# EAGLE design SwitchPi-v0.2 (EAGLE 6.4)
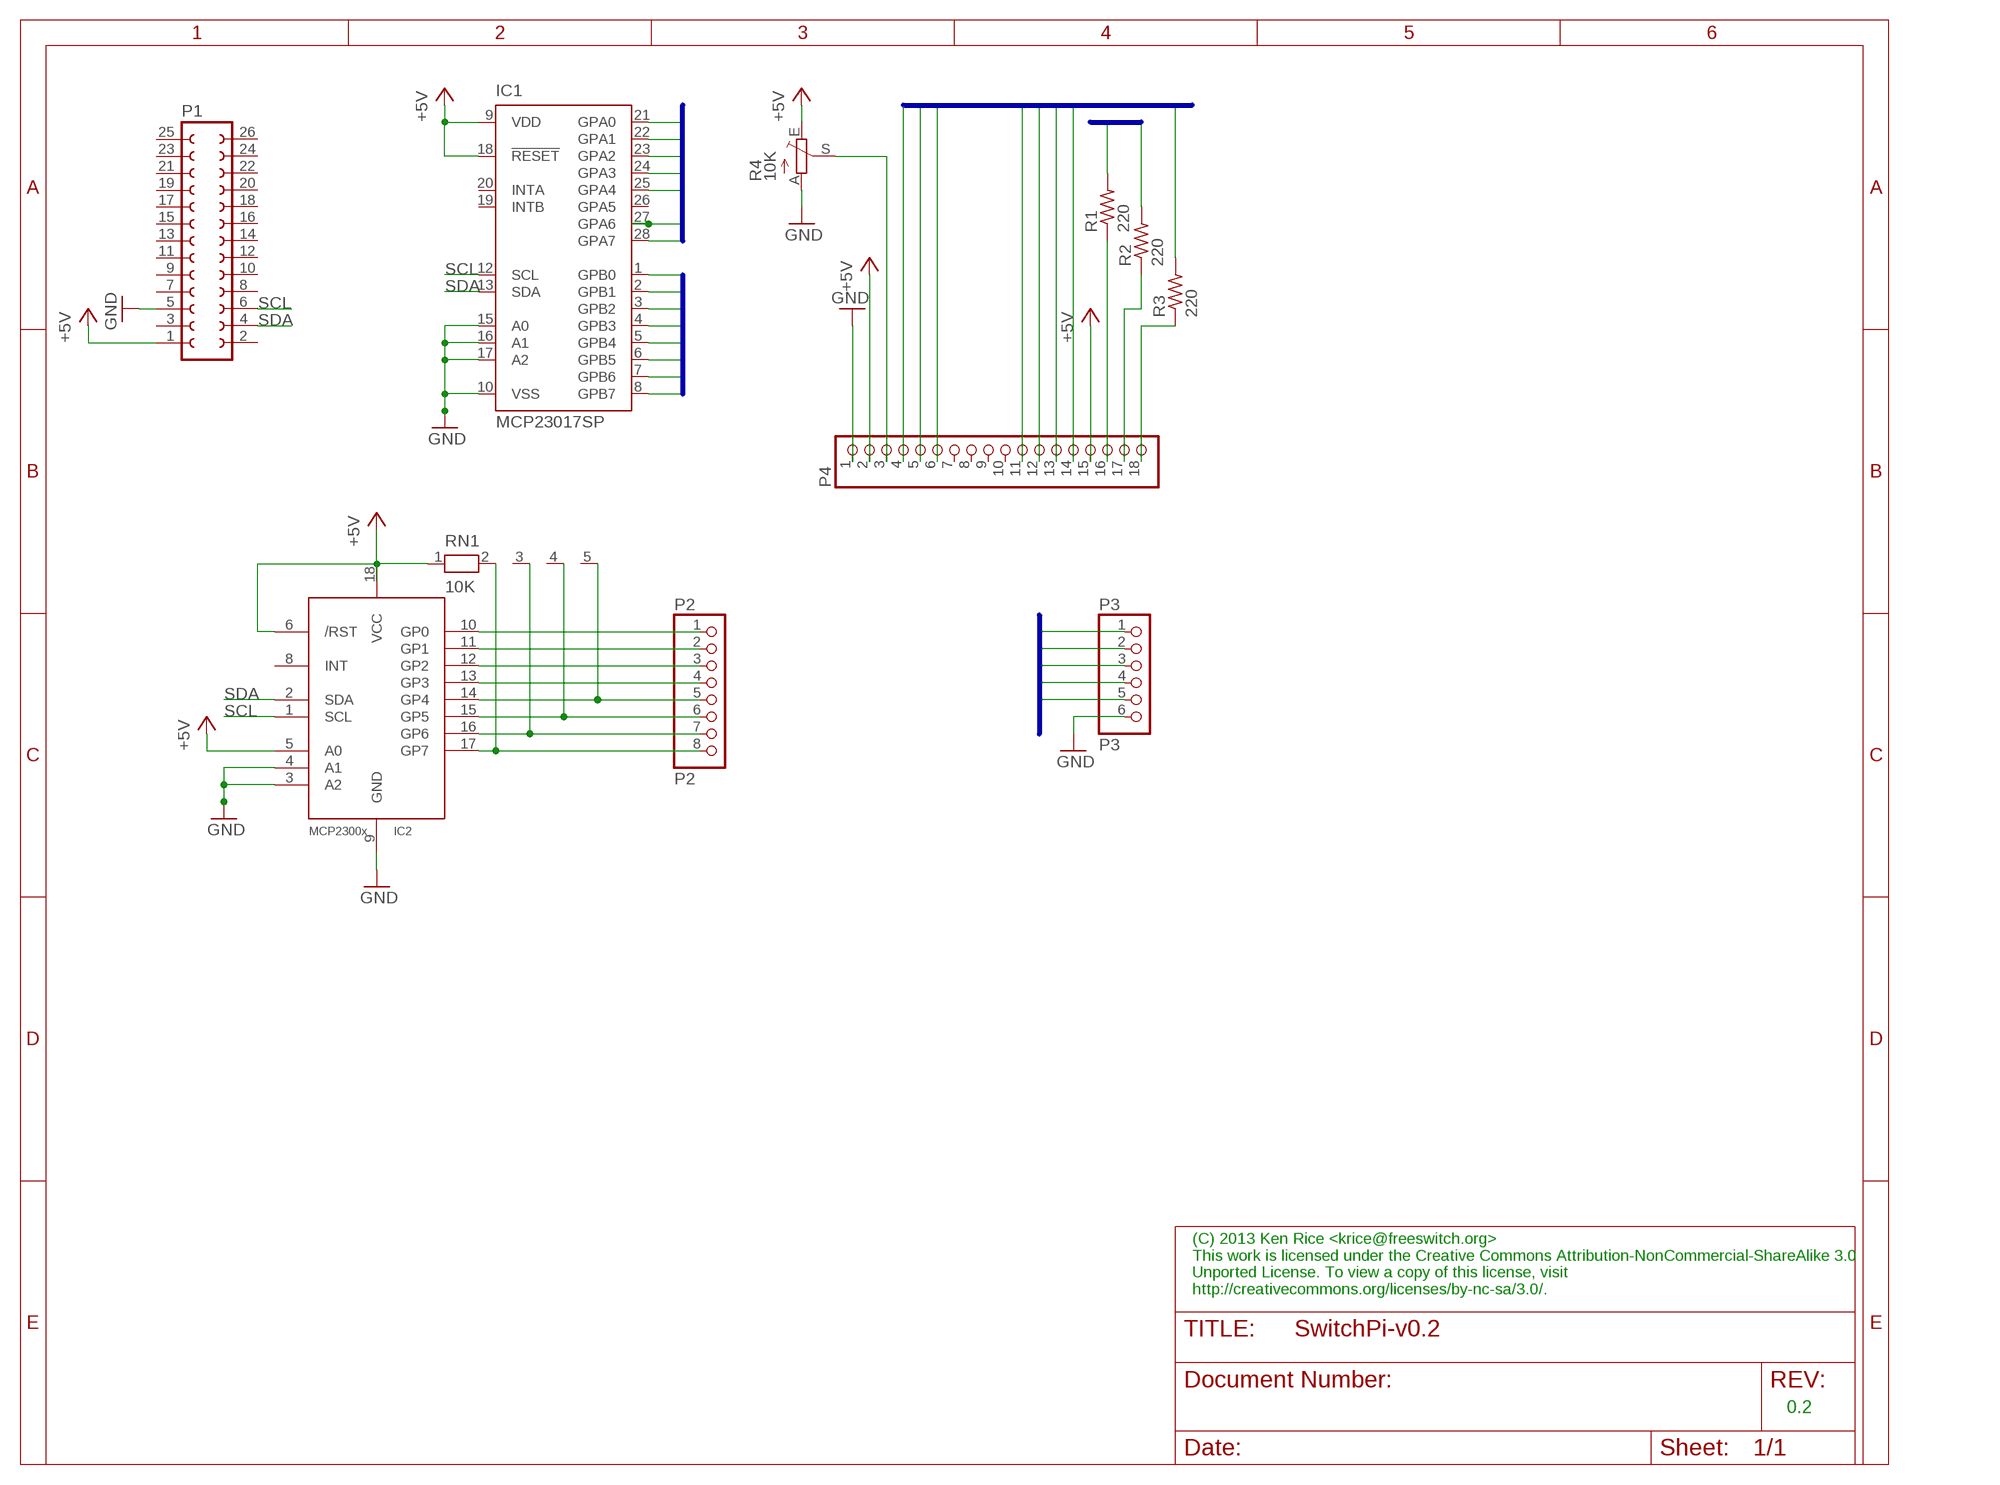
[diagram p0: schematic, sheet 1]

## Parts
IC1  MCP23017SP  [DIL28-3]
IC2  MCP2300X/P  [DIL18]
P1  FE13-2  [FE13-2]
P2  P2  PINHD-1X8BIG  [1X08-BIG]
P3  P3  PINHD-1X6  [1X06]
P4  PINHD-1X18-BIG  [1X18-BIG]
R1  220  R-US_0207/10  [0207/10]
R2  220  R-US_0207/10  [0207/10]
R3  220  R-US_0207/10  [0207/10]
R4  10K  TRIM_EU-CA6V  [CA6V]
RN1  10K  RN04  [RN-5]

## Nets
+5V: IC1.9(VDD) IC1.18(!RESET) IC2.5(A0) IC2.6(/RST) IC2.18(VCC) P1.1 P4.2 P4.15 R4.E RN1.1
GND: IC1.10(VSS) IC1.15(A0) IC1.16(A1) IC1.17(A2) IC2.3(A2) IC2.4(A1) IC2.9(GND) P1.5 P3.6 P4.1 R4.A
GPA0: IC1.21(GPA0) P3.1
GPA1: IC1.22(GPA1) P3.2
GPA2: IC1.23(GPA2) P3.3
GPA3: IC1.24(GPA3) P3.4
GPA4: IC1.25(GPA4) P3.5
GPA6: IC1.27(GPA6) R1.2
GPA7: IC1.28(GPA7) R2.2
GPB0: IC1.1(GPB0) R3.2
GPB1: IC1.2(GPB1) P4.14
GPB2: IC1.3(GPB2) P4.13
GPB3: IC1.4(GPB3) P4.12
GPB4: IC1.5(GPB4) P4.11
GPB5: IC1.6(GPB5) P4.6
GPB6: IC1.7(GPB6) P4.5
GPB7: IC1.8(GPB7) P4.4
N$1: IC2.10(GP0) P2.1
N$2: IC2.11(GP1) P2.2
N$3: P4.3 R4.S
N$4: IC2.12(GP2) P2.3
N$5: P4.16 R1.1
N$6: IC2.13(GP3) P2.4
N$7: IC2.14(GP4) P2.5 RN1.5
N$8: IC2.15(GP5) P2.6 RN1.4
N$9: IC2.16(GP6) P2.7 RN1.3
N$10: IC2.17(GP7) P2.8 RN1.2
N$13: P4.17 R2.1
N$14: P4.18 R3.1
SCL: IC1.12(SCL) IC2.1(SCL) P1.6
SDA: IC1.13(SDA) IC2.2(SDA) P1.4
Unconnected: IC1.19(INTB) IC1.20(INTA) IC1.26(GPA5) IC2.8(INT) P1.2 P1.3 P1.7 P1.8 P1.9 P1.10 P1.11 P1.12 P1.13 P1.14 P1.15 P1.16 P1.17 P1.18 P1.19 P1.20 P1.21 P1.22 P1.23 P1.24 P1.25 P1.26 P4.7 P4.8 P4.9 P4.10

## Buses
GPA[0..7]
GPB[0..7]

## Notes on the sheet
- (C) 2013 Ken Rice <krice@freeswitch.org>
  This work is licensed under the Creative Commons Attribution-NonCommercial-ShareAlike 3.0 
  Unported License. To view a copy of this license, visit
  http://creativecommons.org/licenses/by-nc-sa/3.0/.
- 0.2

## Library data of the parts
IC1 = microchip:MCP23017: http://ww1.microchip.com/downloads/en/DeviceDoc/21952a.pdf Source: http://ww1.microchip.com/downloads/en/DeviceDoc/21952a.pdf; MF: MICROCHIP; MPN: MCP23017-E/SP; OC_FARNELL: 1332088; OC_NEWARK: 31K2959
IC2 = adafruit:MCP2300X: MCP23008 Inexpensive i2c i/o expander - 8 general purpose i/o pins with optional pullups
P1 = con-lsta:FE13-2: FEMALE HEADER; OC_FARNELL: unknown; OC_NEWARK: unknown
P2 = adafruit:PINHD-1X8: PIN HEADER
P3 = adafruit:PINHD-1X6: PIN HEADER
P4 = adafruit:PINHD-1X18: PIN HEADER
R1-R3 = resistor:R-US_: RESISTOR, American symbol
R4 = pot:TRIM_EU-: POTENTIOMETER
RN1 = resistor-net:RN04: RESISTOR NETWORK; OC_FARNELL: unknown; OC_NEWARK: unknown

## Board
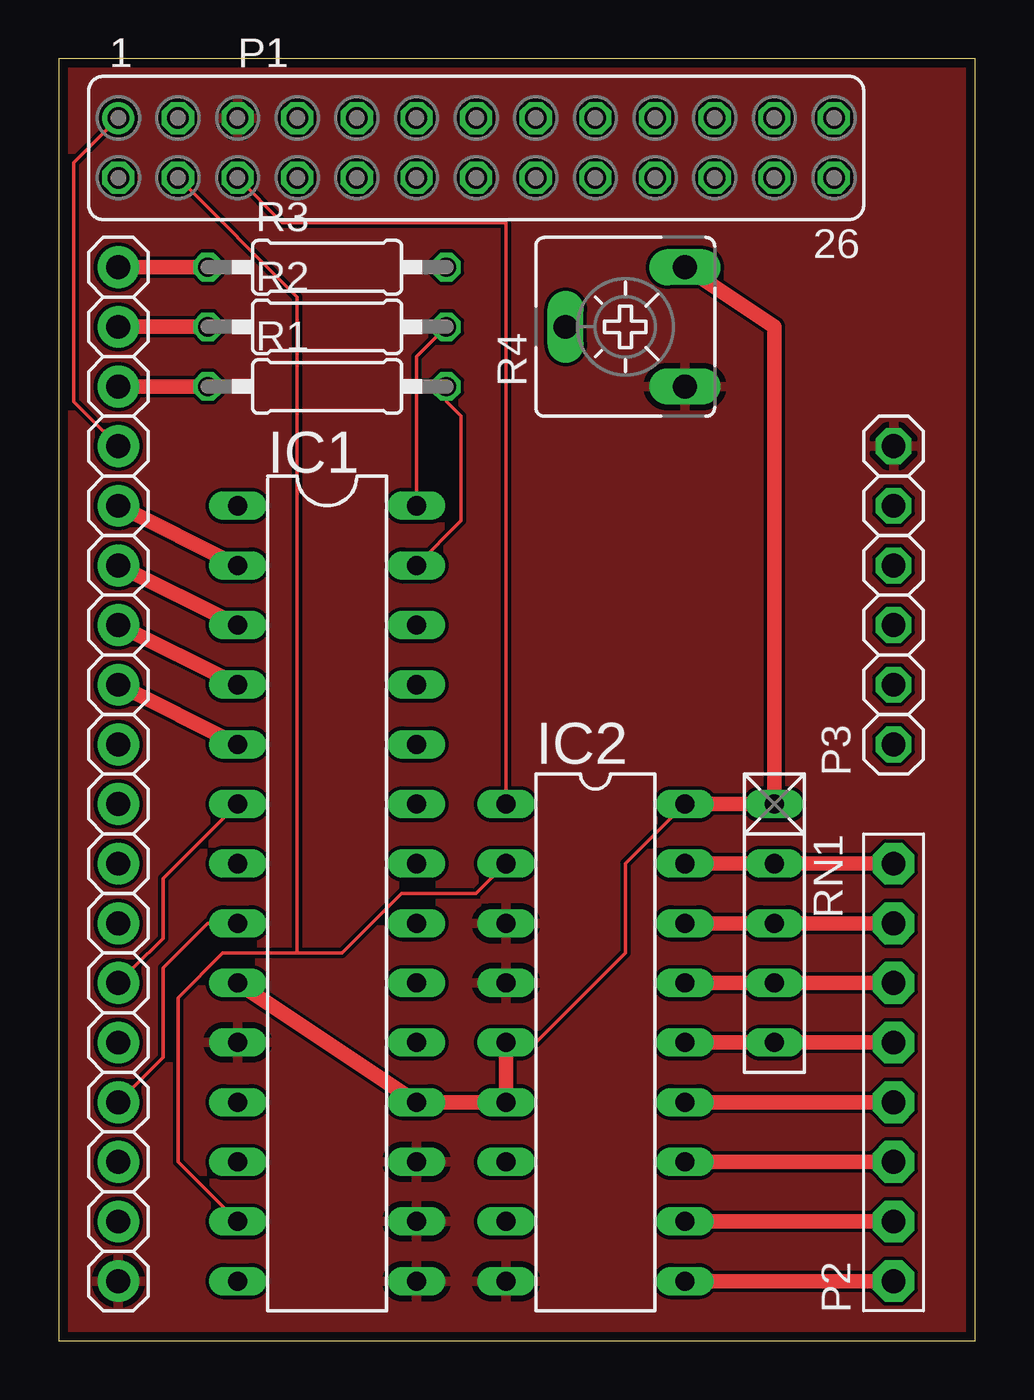
[diagram p1: board, top side]
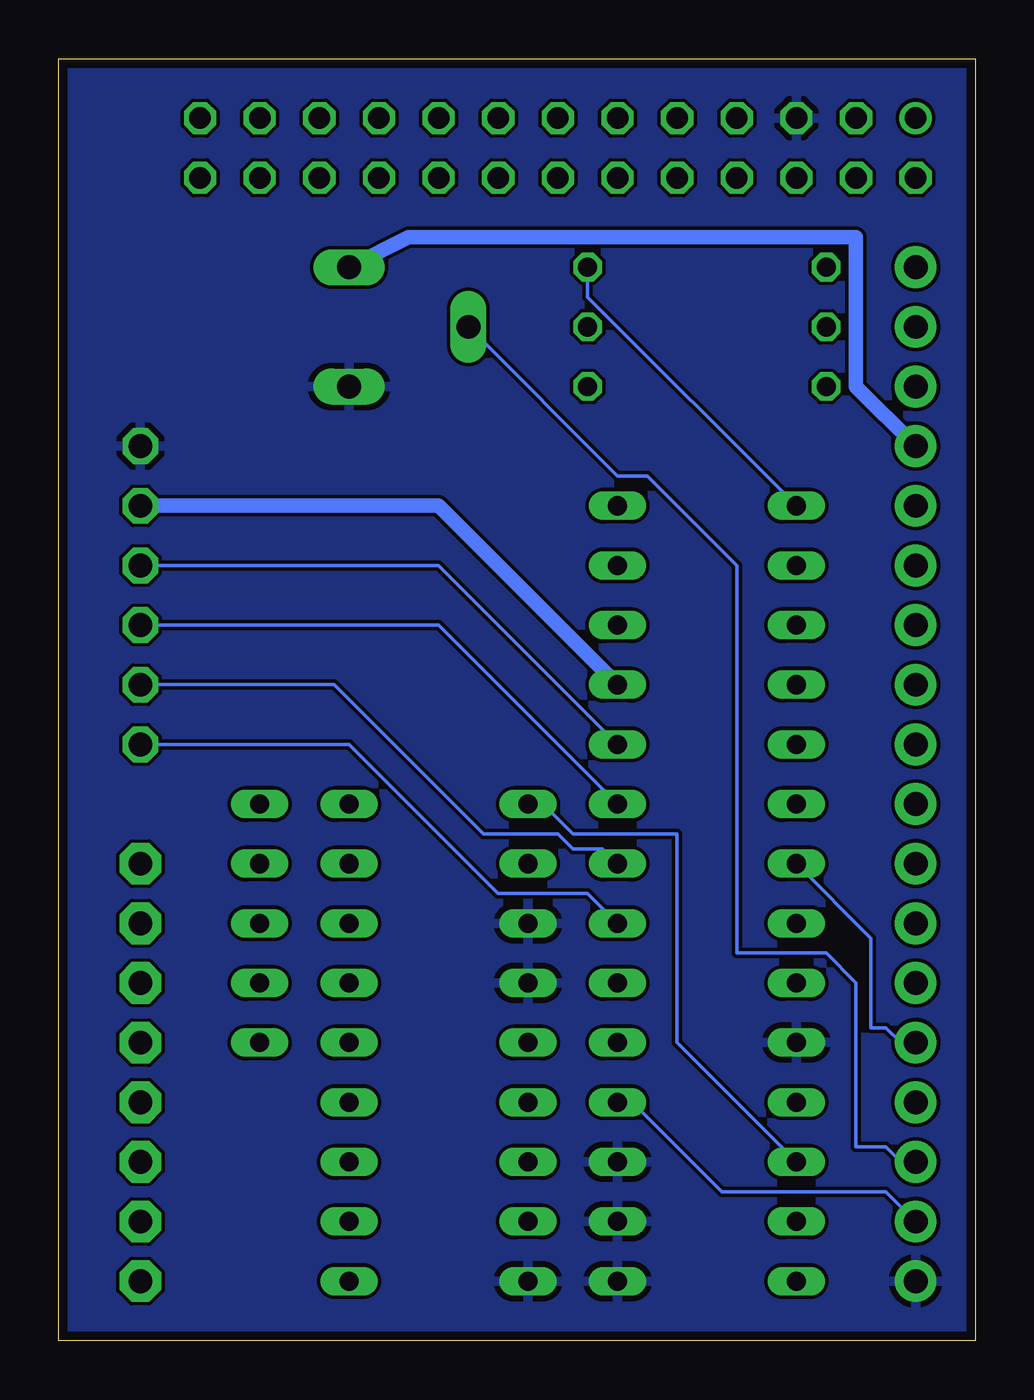
[diagram p2: board, bottom side, seen from below]

Size 39.04 x 54.6 mm. Coordinates in mm from the lower left corner, seen from the top.
Outline: 0,0 39.04,0 39.04,54.6 0,54.6 0,0
Copper layers (1*16): Top 0.0356mm / dielectric 1.5011mm / Bottom 0.0356mm
Design rules "LaenPCBOrder": minimum track width 6mil, minimum drill 13mil, track to track 6mil, track to pad 6mil, pad to pad 6mil, via to via 6mil, smd to smd 6mil, copper to edge 15mil, drill to drill 6mil, minimum pad ring 7mil, minimum via ring 7mil, stop-mask expansion 4mil, vias tented up to drill 0mil, thermal gap 10mil

### Footprints (pad centres in the part's own frame; a part is rotated, then mirrored left to right if it is on the bottom)
DIL28-3 = drill 0.813 long: 1 -16.51,-3.81; 2 -13.97,-3.81; 3 -11.43,-3.81; 4 -8.89,-3.81; 5 -6.35,-3.81; 6 -3.81,-3.81; 7 -1.27,-3.81; 8 1.27,-3.81; 9 3.81,-3.81; 10 6.35,-3.81; 11 8.89,-3.81; 12 11.43,-3.81; 13 13.97,-3.81; 14 16.51,-3.81; 15 16.51,3.81; 16 13.97,3.81; 17 11.43,3.81; 18 8.89,3.81; 19 6.35,3.81; 20 3.81,3.81; 21 1.27,3.81; 22 -1.27,3.81; 23 -3.81,3.81; 24 -6.35,3.81; 25 -8.89,3.81; 26 -11.43,3.81; 27 -13.97,3.81; 28 -16.51,3.81
DIL18 = drill 0.813 long: 1 -10.16,-3.81; 2 -7.62,-3.81; 3 -5.08,-3.81; 4 -2.54,-3.81; 5 0,-3.81; 6 2.54,-3.81; 7 5.08,-3.81; 8 7.62,-3.81; 9 10.16,-3.81; 10 10.16,3.81; 11 7.62,3.81; 12 5.08,3.81; 13 2.54,3.81; 14 0,3.81; 15 -2.54,3.81; 16 -5.08,3.81; 17 -7.62,3.81; 18 -10.16,3.81
FE13-2 = drill 0.914: 1 -15.24,1.27 | drill 0.914 octagon: 2 -15.24,-1.27; 3 -12.7,1.27; 4 -12.7,-1.27; 5 -10.16,1.27; 6 -10.16,-1.27; 7 -7.62,1.27; 8 -7.62,-1.27; 9 -5.08,1.27; 10 -5.08,-1.27; 11 -2.54,1.27; 12 -2.54,-1.27; 13 0,1.27; 14 0,-1.27; 15 2.54,1.27; 16 2.54,-1.27; 17 5.08,1.27; 18 5.08,-1.27; 19 7.62,1.27; 20 7.62,-1.27; 21 10.16,1.27; 22 10.16,-1.27; 23 12.7,1.27; 24 12.7,-1.27; 25 15.24,1.27; 26 15.24,-1.27
1X08-BIG = drill 1.016 pad 1.778 octagon: 1 -8.89,0; 2 -6.35,0; 3 -3.81,0; 4 -1.27,0; 5 1.27,0; 6 3.81,0; 7 6.35,0; 8 8.89,0
1X06 = drill 1.016 octagon: 1 -6.35,0; 2 -3.81,0; 3 -1.27,0; 4 1.27,0; 5 3.81,0; 6 6.35,0
1X18-BIG = drill 1.016 pad 1.778: 1 -21.59,0; 2 -19.05,0; 3 -16.51,0; 4 -13.97,0; 5 -11.43,0; 6 -8.89,0; 7 -6.35,0; 8 -3.81,0; 9 -1.27,0; 10 1.27,0; 11 3.81,0; 12 6.35,0; 13 8.89,0; 14 11.43,0; 15 13.97,0; 16 16.51,0; 17 19.05,0; 18 21.59,0
0207/10 = drill 0.813 octagon: 1 -5.08,0; 2 5.08,0
CA6V = drill 1.016 long: A -2.54,-2.54; E 2.54,-2.54; S 0,2.54
RN-5 = drill 0.813 long: 1 -5.08,0; 2 -2.54,0; 3 0,0; 4 2.54,0; 5 5.08,0

### Placement (x,y rotation side)
IC1  11.43,19.05 270 top
IC2  22.86,12.7 270 top
P1  17.78,50.8 0 top
P2  35.56,11.43 90 top
P3  35.56,31.75 90 top
P4  2.54,24.13 90 top
R1  11.43,40.64 0 top
R2  11.43,43.18 0 top
R3  11.43,45.72 0 top
R4  24.13,43.18 90 top
RN1  30.48,17.78 270 top

### Tracks (layer width: path | path; a pad name or v marks a point on that pad's centre or on a via)
+5V
  Top 0.152: P1.1 0.64,50.16 0.64,40.01 1.91,38.73 2.54,38.73 P4.15 | IC2.5 20.32,12.7 24.13,16.51 24.13,20.32 IC2.18
  Top 0.61: IC2.18 RN1.1 30.48,43.18 R4.E | IC2.5 IC2.6 IC1.18 IC1.9
  Bottom 0.152: P4.2 3.81,6.35 10.79,6.35 14.61,10.16 IC1.18
  Bottom 0.61: P4.15 5.08,40.64 5.08,46.99 24.13,46.99 R4.E
GND
  pour Bottom: 0,54.61 39.37,54.61 39.37,0 0,0
  pour Top: 0,54.61 39.37,54.61 39.37,0 0,0
GPA0
  Bottom 0.152: IC1.21 16.51,19.05 20.32,19.05 26.67,25.4 P3.1
GPA1
  Bottom 0.152: IC1.22 15.88,20.95 17.14,20.95 17.78,21.59 20.95,21.59 27.3,27.94 P3.2
GPA2
  Bottom 0.152: IC1.23 22.86,30.48 P3.3
GPA3
  Bottom 0.152: IC1.24 22.86,33.02 P3.4
GPA4
  Bottom 0.61: IC1.25 22.86,35.56 P3.5
GPA6
  Top 0.152: IC1.27 17.14,34.92 17.14,39.37 16.51,40.01 R1.2
GPA7
  Top 0.152: IC1.28 15.24,41.91 R2.2
GPB0
  Bottom 0.152: IC1.1 16.51,44.45 R3.2
GPB1
  Top 0.61: IC1.2 P4.14
GPB2
  Top 0.61: IC1.3 P4.13
GPB3
  Top 0.61: IC1.4 P4.12
GPB4
  Top 0.61: IC1.5 P4.11
GPB5
  Top 0.152: IC1.6 4.45,19.68 4.45,17.14 3.17,15.88 2.54,15.88 P4.6
GPB6
  Bottom 0.152: IC1.7 4.45,17.14 4.45,13.34 3.81,13.34 3.17,12.7 P4.5
GPB7
  Top 0.152: IC1.8 6.35,17.78 4.45,15.88 4.45,12.06 3.17,10.79 2.54,10.79 P4.4
N$1
  Top 0.61: IC2.10 P2.1
N$2
  Top 0.61: IC2.11 P2.2
N$3
  Bottom 0.152: R4.S 15.24,36.83 13.97,36.83 10.16,33.02 10.16,16.51 6.35,16.51 5.08,15.24 5.08,8.26 3.81,8.26 3.17,7.62 P4.3
N$4
  Top 0.61: IC2.12 P2.3
N$5
  Top 0.61: R1.1 P4.16
N$6
  Top 0.61: IC2.13 P2.4
N$7
  Top 0.61: IC2.14 RN1.5 P2.5
N$8
  Top 0.61: IC2.15 RN1.4 P2.6
N$9
  Top 0.61: IC2.16 RN1.3 P2.7
N$10
  Top 0.61: IC2.17 RN1.2 P2.8
N$13
  Top 0.61: R2.1 P4.17
N$14
  Top 0.61: R3.1 P4.18
SCL
  Top 0.152: P1.6 9.53,47.62 19.05,47.62 IC2.1
  Bottom 0.152: IC1.12 12.7,12.7 12.7,21.59 17.14,21.59 18.41,22.86 IC2.1
SDA
  Top 0.152: IC1.13 5.08,7.62 5.08,14.61 6.99,16.51 10.16,16.51 | 10.16,16.51 12.06,16.51 14.61,19.05 17.78,19.05 IC2.2 | P1.4 10.16,44.45 10.16,16.51